# EasyEDA Pro project USB拓展坞.eprj

# Schematic USB拓展坞原理图
Board Name: USB拓展坞; Create Date: 2025-05-15; Page Name: P1; Project Name: USB拓展坞; Schematic Name: USB拓展坞原理图; Update Date: 2025-05-15; Company: 嘉立创EDA; Page Size: A4; Version: V1.0
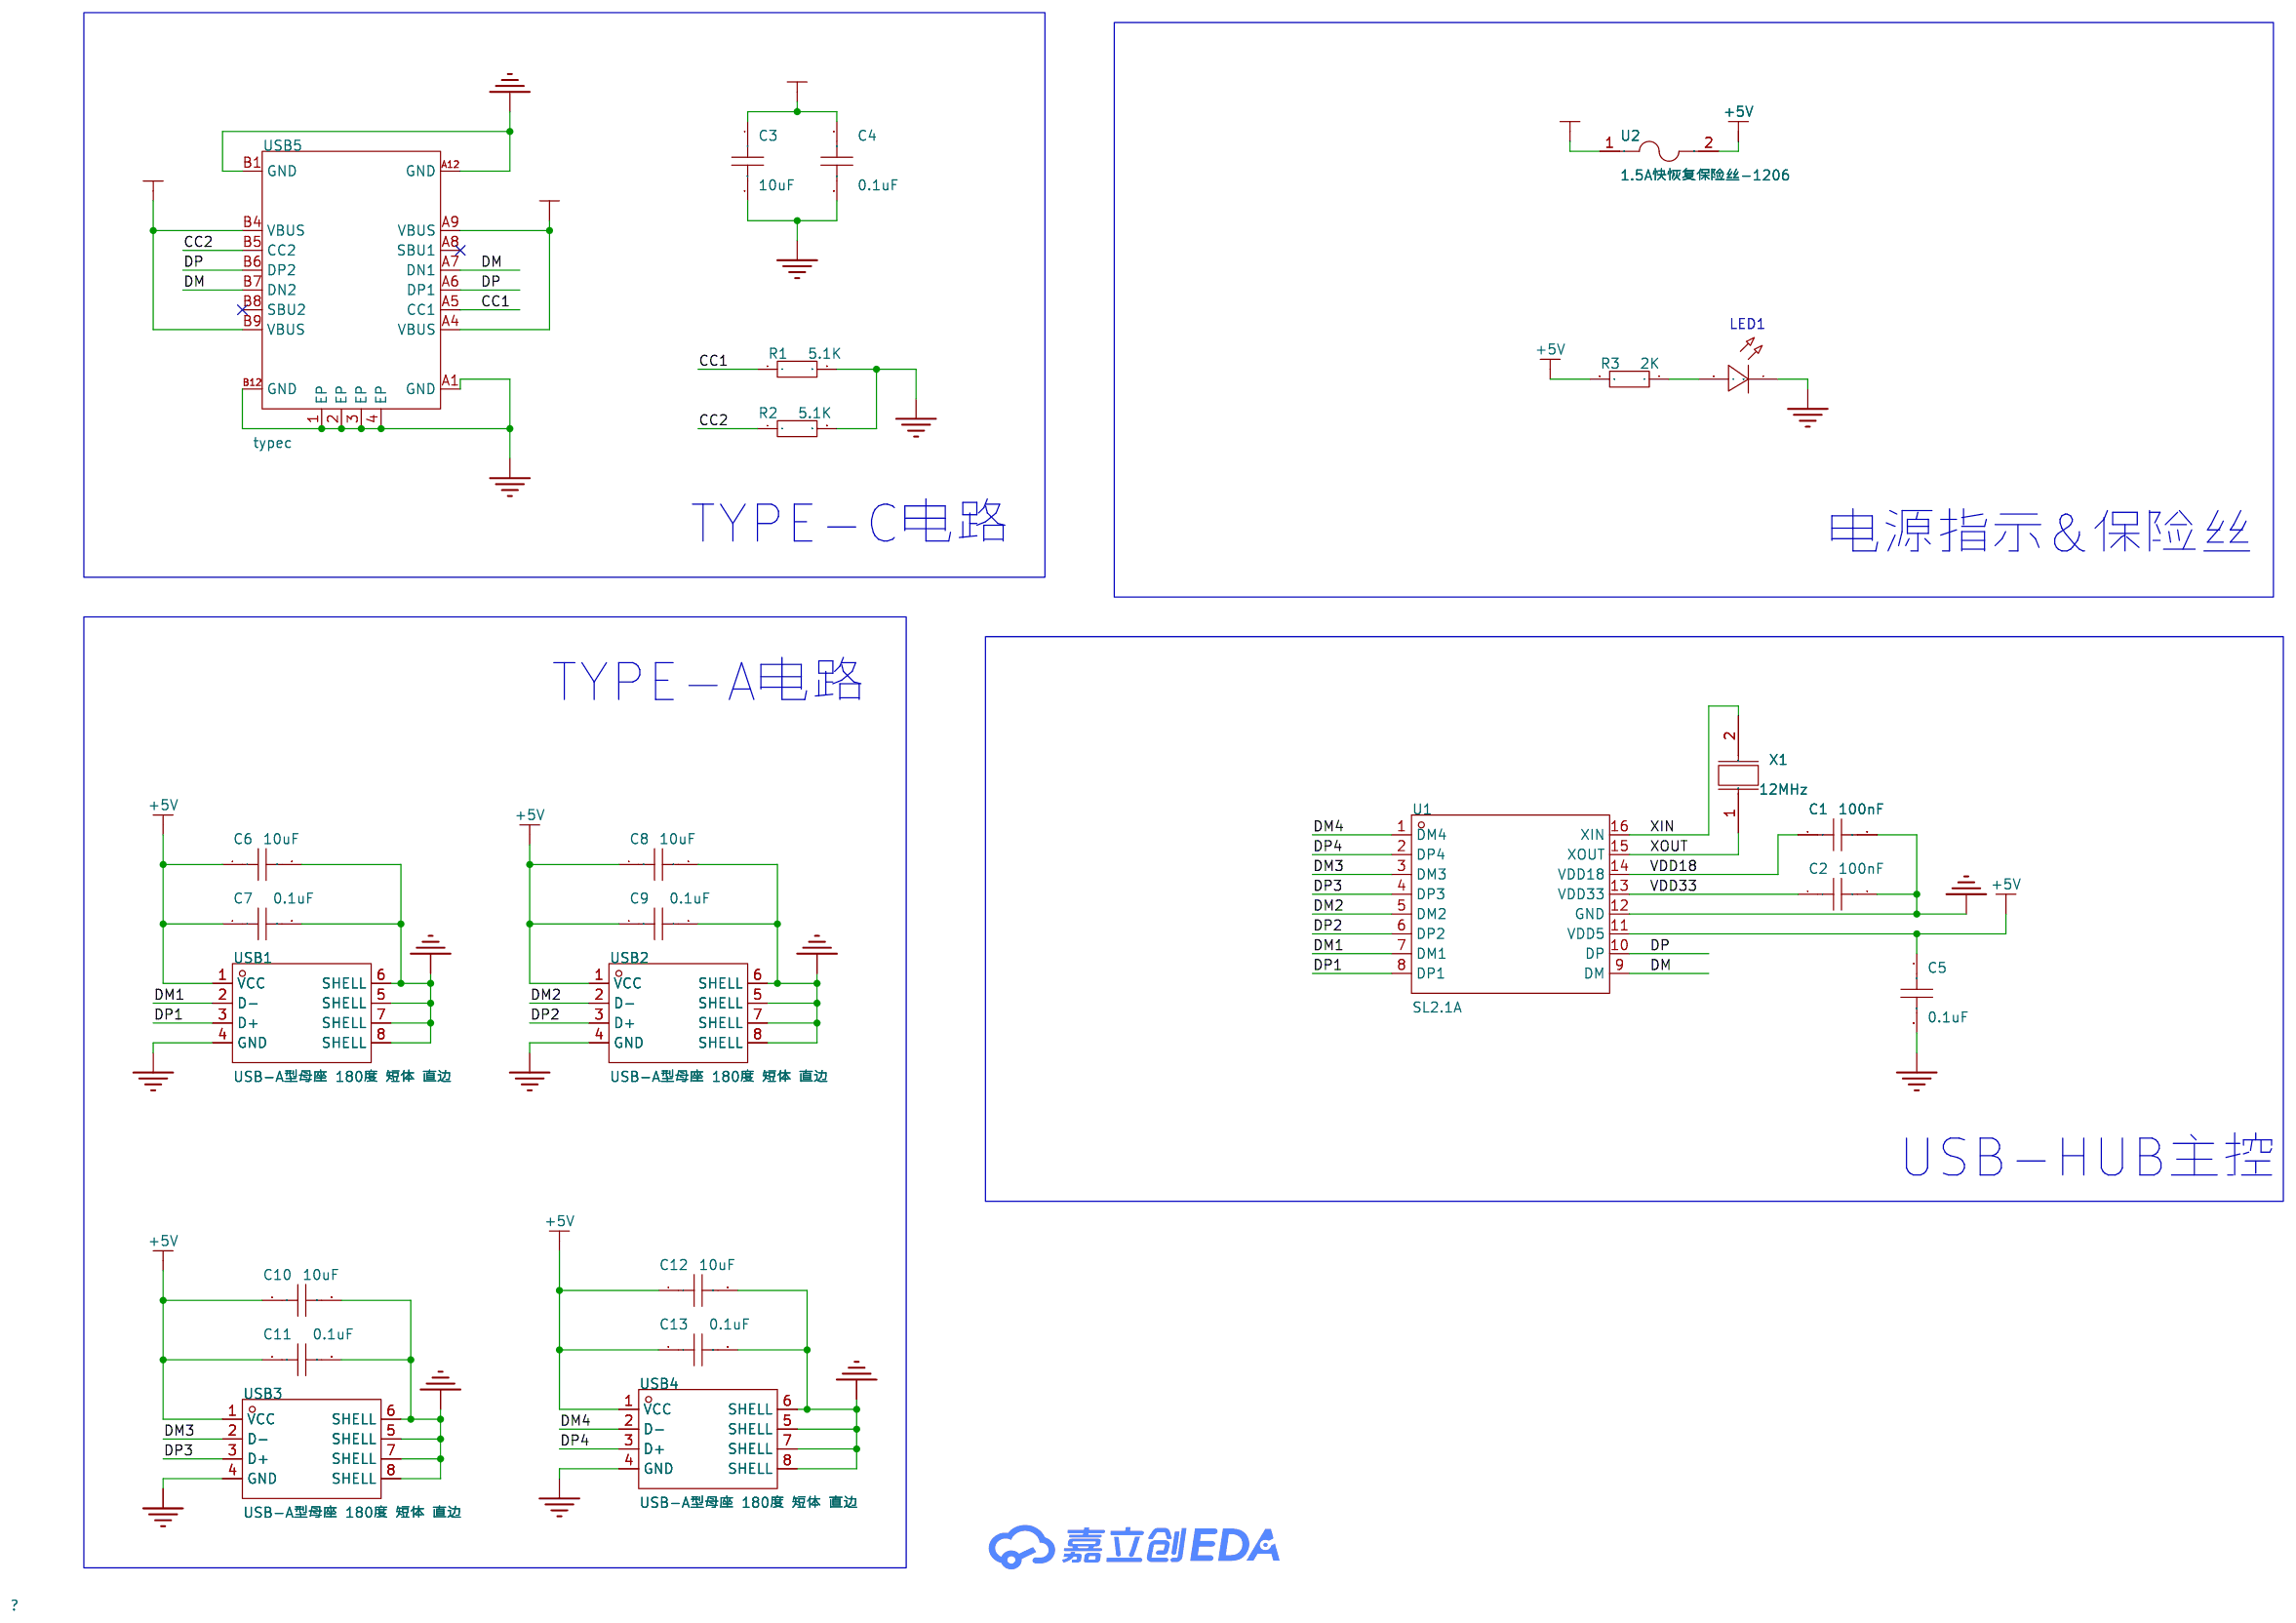
[diagram p0: schematic sheet]

## Parts
C1  100nF  [C0805]
C2  100nF  [C0805]
C3  10uF  [C0805]
C4  0.1uF  [C0805]
C5  0.1uF  [C0805]
C6  10uF  [C0805]
C7  0.1uF  [C0805]
C8  10uF  [C0805]
C9  0.1uF  [C0805]
C10  10uF  [C0805]
C11  0.1uF  [C0805]
C12  10uF  [C0805]
C13  0.1uF  [C0805]
LED1  -  [LED_0805]
R1  5.1K  [R0805]
R2  5.1K  [R0805]
R3  2K  [R0805]
U1  SL2.1A  [SOP-16_L10.0-W3.9-P1.27-LS6.0-BL]
U2  1.5A快恢复保险丝-1206  [F1206]
USB1  USB-A型母座 180度 短体 直边  [USB-A-SMD_WT_C9900004571]
USB2  USB-A型母座 180度 短体 直边  [USB-A-SMD_WT_C9900004571]
USB3  USB-A型母座 180度 短体 直边  [USB-A-SMD_WT_C9900004571]
USB4  USB-A型母座 180度 短体 直边  [USB-A-SMD_WT_C9900004571]
USB5  typec  [USB-C-SMD_KH-TYPE-C-16P]
X1  12MHz  [CRYSTAL-SMD_L5.0-W3.2-1-A]

## Library data of the parts
C1-C13 = CAP_0805: Supplier Footprint: 0805
LED1 = LED_0805-G: Supplier Footprint: 0805
R1-R3 = Res_0805: Supplier Footprint: 0805
U1 = SL2.1A: LCSC Part Name: USB2.0高速4端口HUB控制器; Supplier Part: C192893; Manufacturer: CoreChips(和芯润德); Supplier Footprint: SOP-16; JLCPCB Part Class: 扩展库; Datasheet: https://atta.szlcsc.com/upload/public/pdf/source/20180522/C192893_624110D24898D57AAC785E3DF98EA862.pdf; Supplier: LCSC
U2 = 1.5A快恢复保险丝-1206: Supplier Part: C9900012139; JLCPCB Part Class: 扩展库; Supplier: LCSC
USB1-USB4 = USB-A型母座 180度 短体 直边: Supplier Part: C9900004571; Supplier Footprint: SMD; JLCPCB Part Class: 扩展库; Supplier: LCSC
USB5 = typec: Supplier Part: C9900016956; Supplier Footprint: typec 12p; JLCPCB Part Class: 扩展库; Supplier: LCSC
X1 = 12MHz: Supplier Part: C9900003079; Supplier Footprint: CRYSTAL5032-2P; JLCPCB Part Class: 扩展库; Supplier: LCSC

## Nets
+5V: C5.1 C6.1 C7.1 C8.1 C9.1 C10.1 C11.1 C12.1 C13.1 R3.2 U1.11(VDD5) U2.2 USB1.1(VCC) USB2.1(VCC) USB3.1(VCC) USB4.1(VCC)
GND: C1.2 C2.2 C3.2 C4.2 C5.2 C6.2 C7.2 C8.2 C9.2 C10.2 C11.2 C12.2 C13.2 LED1.1(C) R1.2 R2.2 U1.12(GND) USB1.4(GND) USB1.5(SHELL) USB1.6(SHELL) USB1.7(SHELL) USB1.8(SHELL) USB2.4(GND) USB2.5(SHELL) USB2.6(SHELL) USB2.7(SHELL) USB2.8(SHELL) USB3.4(GND) USB3.5(SHELL) USB3.6(SHELL) USB3.7(SHELL) USB3.8(SHELL) USB4.4(GND) USB4.5(SHELL) USB4.6(SHELL) USB4.7(SHELL) USB4.8(SHELL) USB5.1(EP) USB5.2(EP) USB5.3(EP) USB5.4(EP) USB5.A1(GND) USB5.A12(GND) USB5.B1(GND) USB5.B12(GND)
VCC+5V: C3.1 C4.1 U2.1 USB5.A4(VBUS) USB5.A9(VBUS) USB5.B4(VBUS) USB5.B9(VBUS)
VDD18: C1.1 U1.14(VDD18)
VDD33: C2.1 U1.13(VDD33)
CC1: R1.1 USB5.A5(CC1)
CC2: R2.1 USB5.B5(CC2)
DM: U1.9(DM) USB5.A7(DN1) USB5.B7(DN2)
DM1: U1.7(DM1) USB1.2(D-)
DM2: U1.5(DM2) USB2.2(D-)
DM3: U1.3(DM3) USB3.2(D-)
DM4: U1.1(DM4) USB4.2(D-)
DP: U1.10(DP) USB5.A6(DP1) USB5.B6(DP2)
DP1: U1.8(DP1) USB1.3(D+)
DP2: U1.6(DP2) USB2.3(D+)
DP3: U1.4(DP3) USB3.3(D+)
DP4: U1.2(DP4) USB4.3(D+)
XIN: U1.16(XIN) X1.2
XOUT: U1.15(XOUT) X1.1
$1N3491: LED1.2(A) R3.1

Not connected (* = marked no-connect by the designer): USB5 A8(SBU1)* B8(SBU2)*

## Notes on the sheet
- TYPE-C电路
- 电源指示&保险丝
- TYPE-A电路
- USB-HUB主控

# Board USB拓展坞PCB
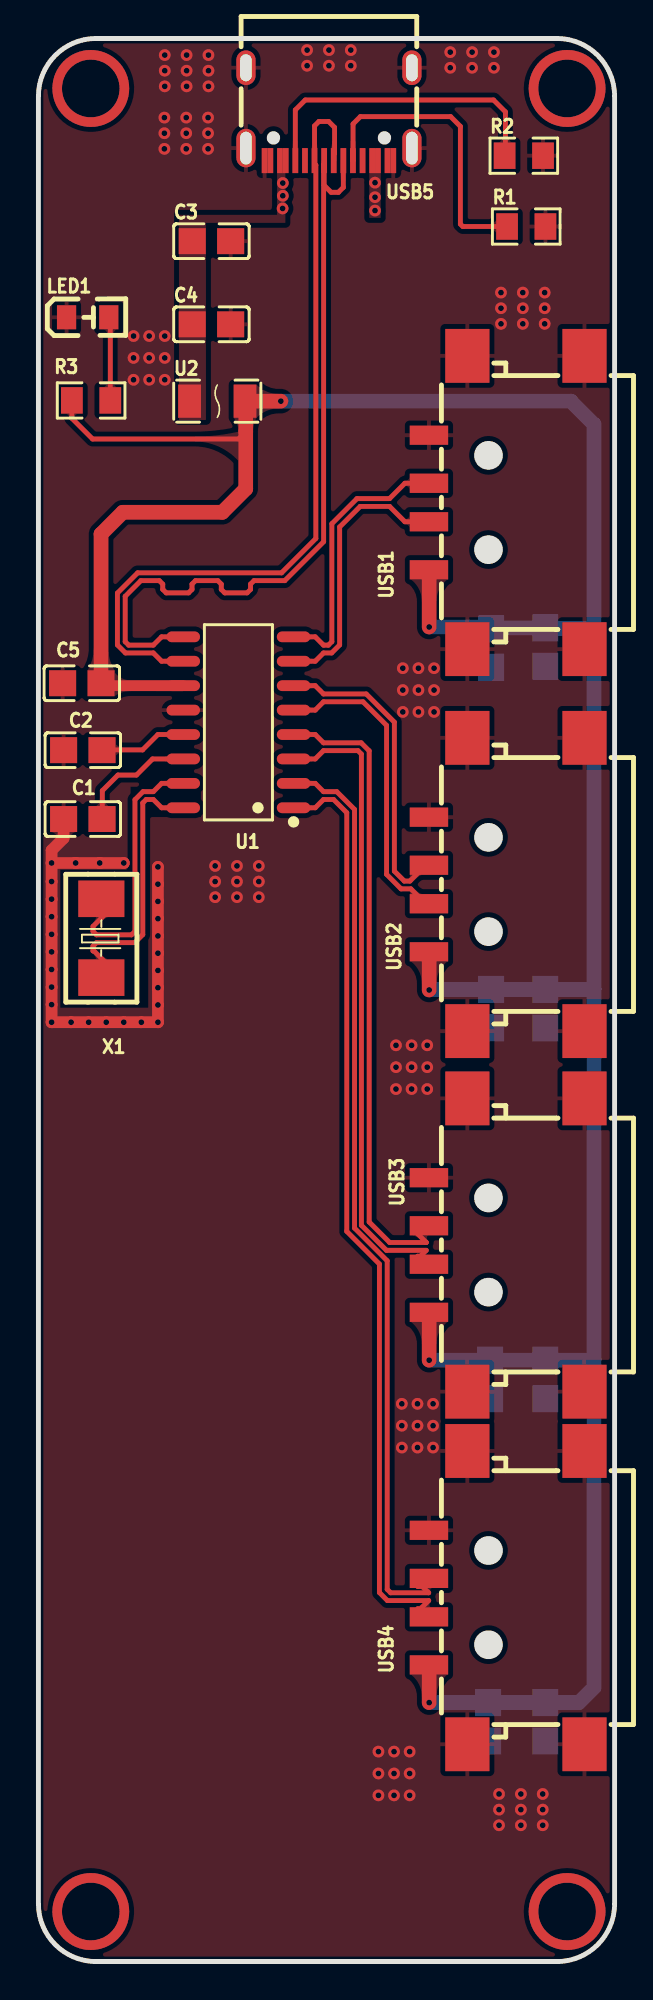
[diagram p1: board, top side]
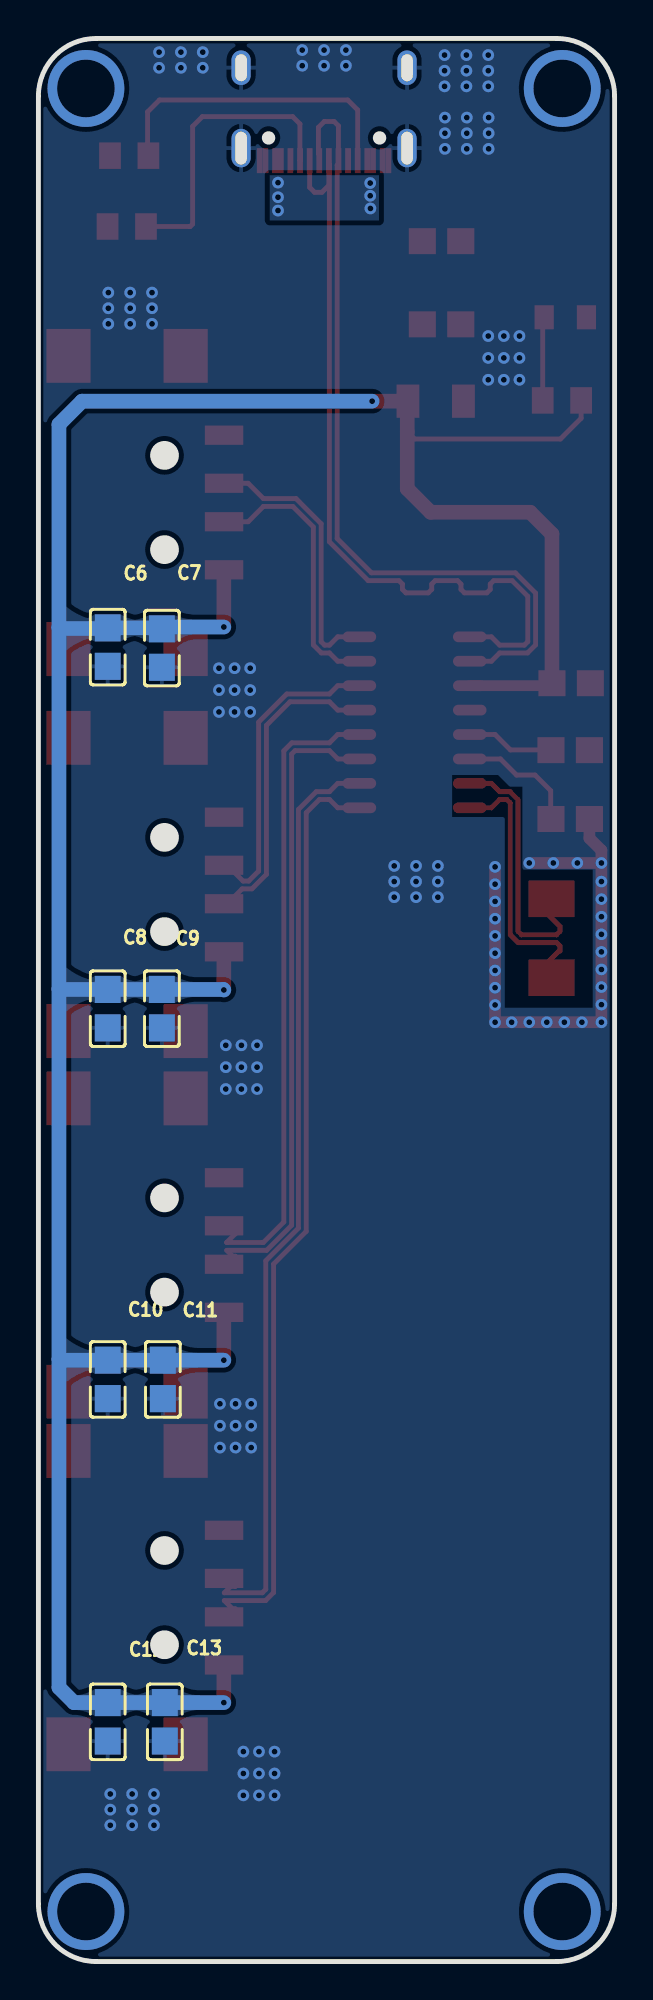
[diagram p2: board, bottom side, seen from below]

Outline 30 x 100 mm; copper layers: Top Layer, Bottom Layer. Coordinates in mm from the lower left corner of the outline.
Outline path: 0,97 0,3 arc(0.88,0.88) 3,0 27,0 arc(29.12,0.88) 30,3 30,97 arc(29.12,99.12) 27,100 3,100 arc(0.88,99.12) 0,97
Stack: Top Layer 0.035mm / Dielectric1 1.51mm FR4 er 4.5 / Bottom Layer 0.035mm

## Design rules (mm)
net DM4: DP4
net DP4: DP4
net DM3: DP3
net DP3: DP3
net DM2: DP2
net DP2: DP2
net DM1: DP1
net DP1: DP1
net XIN: DP6
net XOUT: DP6
net DP: DP5
net DM: DP5
template: 自定义配置
spacing copperThickness1oz (default): track to track 0.102, other pairs 0.152 to 0.3
spacing copperThickness2oz: track to track 0.203, other pairs 0.152 to 0.3
track width copperThickness1oz (default): min 0.127, default 0.254, max 2.54
track width copperThickness2oz: min 0.203, default 0.254, max 2.54
differential pair differentialPair (default): width min 0.127, default 0.254, max 2.54; gap min 0.152, default 0.152
via viaSize (default): diameter min 0.5, default 0.61, max 10; hole min 0.3, default 0.305, max 6.3

## Placement (name value [footprint] x y rotation side)
C1  100nF  [C0805]  2.31 59.41 180 top
C2  100nF  [C0805]  2.31 62.99 180 top
C3  10uF  [C0805]  9.01 89.46 0 top
C4  0.1uF  [C0805]  9.01 85.14 0 top
C5  0.1uF  [C0805]  2.26 66.47 180 top
C6  10uF  [C0805]  26.39 68.35 270 bottom
C7  0.1uF  [C0805]  23.57 68.3 270 bottom
C8  10uF  [C0805]  26.39 49.55 270 bottom
C9  0.1uF  [C0805]  23.57 49.55 270 bottom
C10  10uF  [C0805]  26.39 30.27 270 bottom
C11  0.1uF  [C0805]  23.52 30.27 270 bottom
C12  10uF  [C0805]  26.39 12.47 270 bottom
C13  0.1uF  [C0805]  23.42 12.47 270 bottom
LED1  -  [LED_0805]  2.62 85.5 0 top
R1  5.1K  [R0805]  25.4 90.22 0 top
R2  5.1K  [R0805]  25.27 93.9 0 top
R3  2K  [R0805]  2.74 81.18 180 top
U1  SL2.1A  [SOP-16_L10.0-W3.9-P1.27-LS6.0-BL]  10.41 64.44 90 top
U2  1.5A快恢复保险丝-1206  [F1206]  9.31 81.14 0 top
USB1  USB-A型母座 180度 短体 直边  [USB-A-SMD_WT_C9900004571]  24.38 75.87 90 top
USB2  USB-A型母座 180度 短体 直边  [USB-A-SMD_WT_C9900004571]  24.38 56.01 90 top
USB3  USB-A型母座 180度 短体 直边  [USB-A-SMD_WT_C9900004571]  24.38 37.26 90 top
USB4  USB-A型母座 180度 短体 直边  [USB-A-SMD_WT_C9900004571]  24.38 18.92 90 top
USB5  typec  [USB-C-SMD_KH-TYPE-C-16P]  15.13 96.06 180 top
X1  12MHz  [CRYSTAL-SMD_L5.0-W3.2-1-A]  3.28 53.21 270 top

## Footprints (pads in the part's own frame, mm; a bottom-side part is the same pattern mirrored in y, then rotated)
C0805
  rect 1.41x1.35 smd: 1(-1,0) 2(1,0)
CRYSTAL-SMD_L5.0-W3.2-1-A
  rect 1.9x2.4 smd: 1(-2.05,0) 2(2.05,0)
F1206
  rect 1.19x1.728 smd: 1(-1.445,0) 2(1.445,0)
LED_0805
  rect 1x1.25 smd: 1(-1.15,0.005) 2(1.05,0.005)
R0805
  rect 1.133x1.377 smd: 1(-1,0) 2(1,0)
SOP-16_L10.0-W3.9-P1.27-LS6.0-BL
  oval 0.56x1.745 smd: 1(-4.445,-2.873) 2(-3.175,-2.873) 3(-1.905,-2.873) 4(-0.635,-2.873) 5(0.635,-2.873) 6(1.905,-2.873) 7(3.175,-2.873) 8(4.445,-2.873) 9(4.445,2.873) 10(3.175,2.873) 11(1.905,2.873) 12(0.635,2.873) 13(-0.635,2.873) 14(-1.905,2.873) 15(-3.175,2.873) 16(-4.445,2.873)
USB-A-SMD_WT_C9900004571
  rect 1x2 smd: 1(-3.5,4.05) 2(-1,4.05) 3(1,4.05) 4(3.5,4.05)
  rect 2.8x2.3 smd: 5(-7.625,2.05) 6(-7.625,-4.05) 7(7.625,-4.05) 8(7.625,2.05)
USB-C-SMD_KH-TYPE-C-16P
  oval 1x2 hole 0.6x1.7: 1(-4.32,1.765) 2(4.32,1.765)
  oval 1x1.8 hole 0.6x1.4: 3(-4.32,-2.415) 4(4.32,-2.415)
  rect 0.3x1.3 smd: A1(-3.35,2.415) A4(-2.55,2.415) A5(-1.25,2.415) A6(-0.25,2.415) A7(0.25,2.415) A8(1.25,2.415) A9(2.55,2.415) A12(3.35,2.415) B1(3.05,2.415) B4(2.25,2.415) B5(1.75,2.415) B6(0.75,2.415) B7(-0.75,2.415) B8(-1.75,2.415) B9(-2.25,2.415) B12(-3.05,2.415)

## Nets
As in the schematic.

Pads without a net: USB5 A8 B8

## Via types
v1: diameter 4, hole 3, Top Layer to Bottom Layer, 4 vias
v2: diameter 0.61, hole 0.305, Top Layer to Bottom Layer, 141 vias

## Routing (per net, layer and track width the routed paths; a pad name or vN(x,y) marks a point on that pad's centre or on a via; arc(x,y) is an arc through that point)
+5V: length 164.3
  Top Layer w0.254: 10.8,79.55 10.41,79.17 2.82,79.17 1.74,80.25 R3.2
  Top Layer w0.559: U1.11 3.39,66.34 C5.1
  Top Layer w0.762: C5.1 3.26,74.23 4.39,75.36 9.58,75.36 10.8,76.58 10.8,81.1 U2.2 v2(12.62,81.14) ; v2(20.35,13.47) 20.35,15.41 USB4.1 ; USB3.1 20.35,33.75 v2(20.35,31.27) ; v2(20.35,50.52) 20.35,52.5 USB2.1 ; USB1.1 20.35,72.36 v2(20.35,69.4)
  Bottom Layer w0.762: v2(20.35,31.27) C11.1 C10.1 26.39,31.27 28.83,31.27 28.88,31.32 28.93,31.32 ; v2(20.35,13.47) C13.1 C12.1 28.15,13.47 28.93,14.25 28.93,31.32 ; 28.93,69.37 28.93,50.57 ; 28.93,69.37 28.93,79.93 27.73,81.14 v2(12.62,81.14) ; 28.93,69.37 28.88,69.32 26.43,69.32 C6.1 23.65,69.35 23.6,69.3 23.5,69.4 v2(20.35,69.4) ; 28.93,50.57 28.91,50.55 C8.1 C9.1 20.37,50.55 v2(20.35,50.52) ; 28.93,50.57 28.93,31.32
GND: length 28.2
  Top Layer w0.61: v2(0.69,57.12) v2(0.69,56.16) v2(0.69,55.25) v2(0.69,54.33) v2(0.69,53.42) v2(0.69,52.5) v2(0.69,51.59) v2(0.69,50.67) v2(0.69,49.76) v2(0.69,48.84) v2(1.7,48.84) v2(2.62,48.84) v2(3.53,48.84) v2(4.45,48.84) v2(5.36,48.84) v2(6.22,48.84) v2(6.22,49.74) v2(6.22,50.64) v2(6.22,51.54) v2(6.22,52.43) v2(6.22,53.33) v2(6.22,54.23) v2(6.22,55.13) v2(6.22,56.02) v2(6.22,56.92) ; v2(0.69,57.12) v2(1.94,57.12) v2(3.19,57.12) v2(4.44,57.12) ; v2(0.69,57.12) 0.69,57.78 1.31,58.41 C1.2
  vias: v2(4.95,84.53) v2(4.95,83.39) v2(4.95,82.25) v2(5.77,84.53) v2(5.77,83.39) v2(5.77,82.25) v2(6.56,95.89) v2(6.56,95.07) v2(6.56,94.26) v2(6.58,99.14) v2(6.58,98.32) v2(6.58,97.51) v2(6.58,84.53) v2(6.58,83.39) v2(6.58,82.25) v2(7.72,99.14) v2(7.72,98.32) v2(7.72,97.51) v2(7.7,95.89) v2(7.7,95.07) v2(7.7,94.26) v2(8.85,99.14) v2(8.85,98.32) v2(8.85,97.51) v2(8.83,95.89) v2(8.83,95.07) v2(8.83,94.26) v2(9.2,56.97) v2(9.2,56.16) v2(9.2,55.35) v2(10.34,56.97) v2(10.34,56.16) v2(10.34,55.35) v2(11.48,56.97) v2(11.48,56.16) v2(11.48,55.35) v2(13.99,99.4) v2(13.99,98.58) v2(15.13,99.4) v2(15.13,98.58) v2(16.26,99.4) v2(16.26,98.58) v2(17.7,10.92) v2(17.7,9.78) v2(17.7,8.64) v2(18.52,10.92) v2(18.52,9.78) v2(18.52,8.64) v2(18.62,47.64) v2(18.62,46.51) v2(18.62,45.37) v2(18.97,67.25) v2(18.97,66.12) v2(18.97,64.98) v2(18.92,29) v2(18.92,27.86) v2(18.92,26.73) v2(19.33,10.92) v2(19.33,9.78) v2(19.33,8.64) v2(19.43,47.64) v2(19.43,46.51) v2(19.43,45.37) v2(19.74,29) v2(19.74,27.86) v2(19.74,26.73) v2(19.79,67.25) v2(19.79,66.12) v2(19.79,64.98) v2(20.24,47.64) v2(20.24,46.51) v2(20.24,45.37) v2(20.55,29) v2(20.55,27.86) v2(20.55,26.73) v2(20.6,67.25) v2(20.6,66.12) v2(20.6,64.98) v2(21.44,99.29) v2(21.44,98.48) v2(22.58,99.29) v2(22.58,98.48) v2(23.72,99.29) v2(23.72,98.48) v2(23.98,8.71) v2(23.98,7.9) v2(23.98,7.09) v2(24.09,86.79) v2(24.09,85.97) v2(24.09,85.16) v2(25.12,8.71) v2(25.12,7.9) v2(25.12,7.09) v2(25.22,86.79) v2(25.22,85.97) v2(25.22,85.16) v2(26.26,8.71) v2(26.26,7.9) v2(26.26,7.09) v2(26.36,86.79) v2(26.36,85.97) v2(26.36,85.16)
VCC+5V:
  vias: v2(12.73,92.48) v2(12.73,91.82) v2(12.71,91.16) v2(17.53,92.5) v2(17.53,91.75) v2(17.53,91.05)
VDD18: length 6.4
  Top Layer w0.254: C1.1 3.33,59.43 3.33,60.88 4.14,61.7 5.11,61.7 5.94,62.53 U1.14
VDD33: length 4.6
  Top Layer w0.254: U1.13 6.22,63.81 5.42,63 3.32,63 C2.1
(no net):
  vias: v1(2.73,97.4) v1(2.73,2.6) v1(27.53,97.4) v1(27.53,2.6)
CC1: length 15.4
  Top Layer w0.254: R1.1 22.1,90.22 21.97,90.35 21.97,95.43 21.46,95.94 16.76,95.94 16.38,95.56 16.38,93.65 USB5.A5
CC2: length 16.3
  Top Layer w0.254: R2.1 24.27,93.95 24.32,94 24.32,96.18 23.7,96.8 13.89,96.8 13.38,96.28 USB5.B5
DM: length 42.4
  Top Layer w0.254: 14.88,93.48 14.85,93.45 14.85,73.83 12.83,71.81 11.23,71.81 11.05,71.63 11.05,71.35 10.87,71.17 9.7,71.17 9.52,71.35 9.52,71.63 9.34,71.81 8.18,71.81 8,71.63 8,71.35 7.82,71.17 6.65,71.17 6.47,71.35 6.47,71.63 6.29,71.81 5.33,71.81 4.52,70.99 4.52,68.63 4.7,68.45 5.98,68.45 6.42,68.89 U1.9 ; 14.88,93.48 14.88,92.36 15.24,92 15.62,92 15.88,92.25 USB5.B7 ; 14.88,93.48 USB5.A7
DM1: length 14.3
  Top Layer w0.254: USB1.2 19.08,74.87 18.28,75.67 16.75,75.67 15.68,74.6 15.68,68.46 15.27,68.05 14.84,68.05 14.41,67.61 U1.7
DM2: length 16.1
  Top Layer w0.254: USB2.2 20.17,55.01 19.39,55.78 18.88,55.78 18.13,56.53 18.13,64.28 16.9,65.51 14.84,65.51 14.41,65.08 U1.5
DM3: length 33.5
  Top Layer w0.254: USB3.2 20.17,36.26 19.75,36.68 19.89,36.68 20.19,36.98 18.12,36.98 16.82,38.29 16.82,62.79 16.64,62.97 14.84,62.97 14.41,62.53 U1.3
DM4: length 48.7
  Top Layer w0.254: U1.1 14.41,60 14.84,60.43 15.37,60.43 16.05,59.74 16.05,37.97 17.75,36.27 17.75,19.19 18.17,18.77 20.32,18.77 19.89,18.34 19.75,18.34 20.17,17.92 USB4.2
DP: length 42.5
  Top Layer w0.254: U1.10 6.42,67.61 5.98,68.05 4.53,68.05 4.11,68.46 4.11,71.16 5.17,72.21 12.66,72.21 14.45,74 14.45,93.41 14.38,93.48 USB5.B6 14.38,95.45 14.61,95.68 15.11,95.68 15.42,95.38 15.42,94.02 15.38,93.97 USB5.A6
DP1: length 14.3
  Top Layer w0.254: U1.8 14.41,68.89 14.84,68.45 15.1,68.45 15.28,68.63 15.28,74.77 16.59,76.07 18.28,76.07 19.08,76.87 USB1.3
DP2: length 16.1
  Top Layer w0.254: U1.6 14.41,66.34 14.84,65.91 17.07,65.91 18.53,64.45 18.53,56.7 19.05,56.19 19.34,56.19 20.17,57.01 USB2.3
DP3: length 33.6
  Top Layer w0.254: USB3.3 20.17,38.26 19.75,37.84 20.19,37.4 20.19,37.39 18.29,37.39 17.22,38.45 17.22,62.96 16.81,63.37 14.84,63.37 14.41,63.81 U1.4
DP4: length 48.7
  Top Layer w0.254: USB4.3 20.17,19.92 19.75,19.51 19.99,19.51 20.32,19.18 18.34,19.18 18.16,19.35 18.16,36.44 16.46,38.14 16.46,59.91 15.53,60.83 14.84,60.83 14.41,61.27 U1.2
XIN: length 14.5
  Top Layer w0.254: X1.2 3.45,51.16 3.86,51.58 2.89,52.55 2.84,52.55 2.84,52.8 3.02,52.98 5.02,52.98 5.43,53.4 5.43,60.25 5.61,60.43 5.98,60.43 6.42,60 U1.16
XOUT: length 14.5
  Top Layer w0.254: U1.15 6.42,61.27 5.98,60.83 5.45,60.83 5.03,60.42 5.03,53.57 4.85,53.39 3.02,53.39 2.84,53.57 2.84,53.83 3.86,54.85 3.45,55.26 3.28,55.26
$1N3491: length 4.4
  Top Layer w0.254: R3.1 3.74,85.42 LED1.2

## Copper pours and planes (outline as drawn; the poured copper is in the pictures)
GND on Top Layer: -5.31,101.27 35.64,101.27 35.64,-5.16 -5.31,-5.16
GND on Bottom Layer: -2.11,99.75 34.67,99.75 34.67,-3.02 -2.11,-3.02
VCC+5V on Top Layer: 17.23,94.2 17.82,94.2 17.82,90.67 17.23,90.67
VCC+5V on Top Layer: 7.32,94.2 12.86,94.2 12.86,80.16 7.32,80.16
VCC+5V on Bottom Layer: 12.27,92.89 17.96,92.89 17.96,90.54 12.27,90.54

Small or netless copper shapes (teardrops, artwork), in the pictures only: 100 on Top Layer, 19 on Bottom Layer
